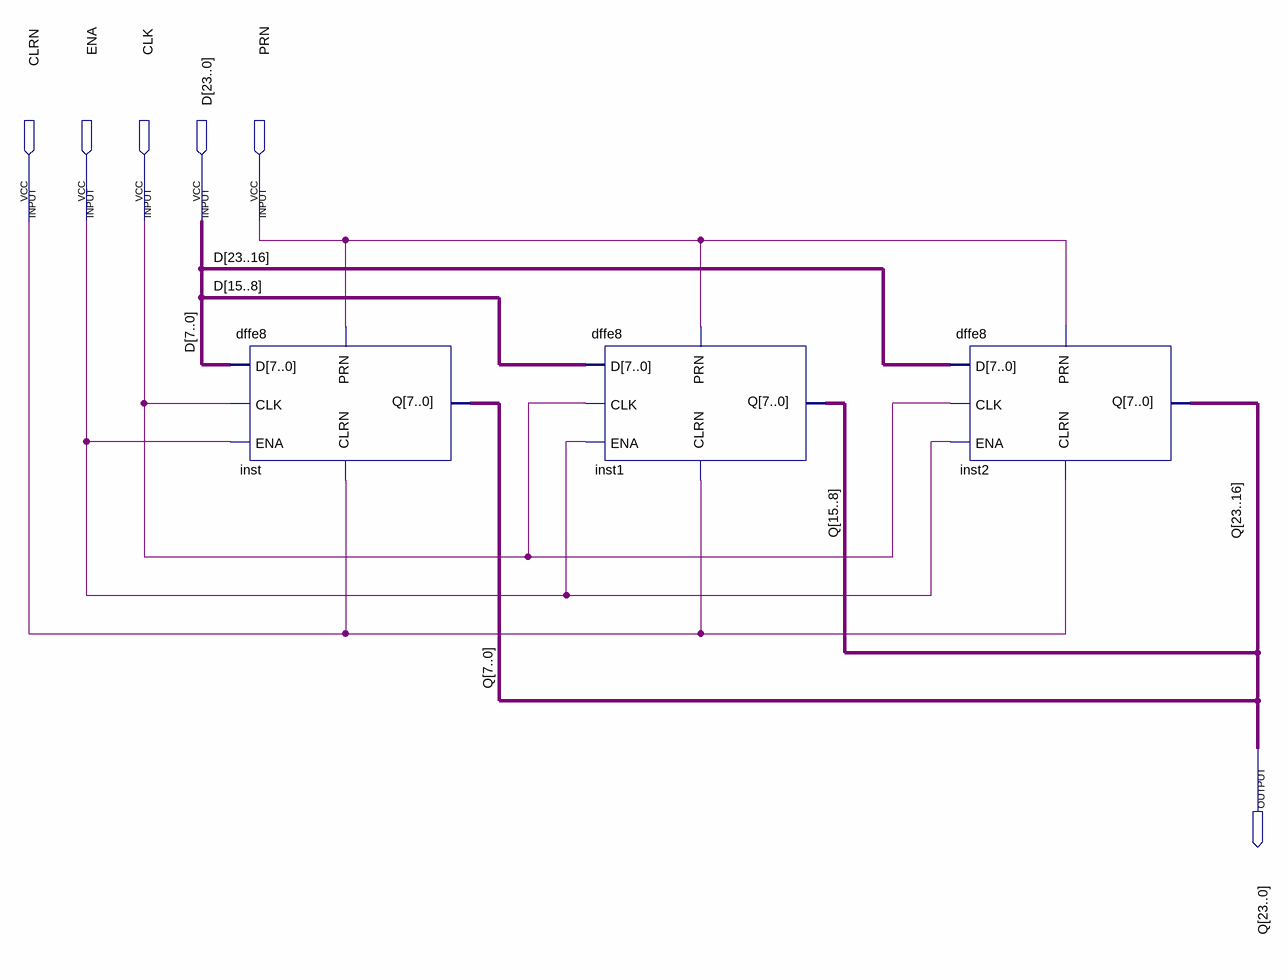
[diagram p0: schematic sheet]
// Quartus schematic dffe24.bdf as structural Verilog: 3 symbols, 6 pins
module dffe24 (
  input  CLRN,
  input  ENA,
  input  CLK,
  input  [23:0] D,
  input  PRN,
  output [23:0] Q
);

  dffe8 inst (.PRN(PRN), .CLK(CLK), .D(D[7:0]), .ENA(ENA), .CLRN(CLRN), .Q(Q[7:0]));
  dffe8 inst1 (.PRN(PRN), .CLK(CLK), .D(D[15:8]), .ENA(ENA), .CLRN(CLRN), .Q(Q[15:8]));
  dffe8 inst2 (.PRN(PRN), .CLK(CLK), .D(D[23:16]), .ENA(ENA), .CLRN(CLRN), .Q(Q[23:16]));
endmodule
